# Altium schematic sheet ODChannel.SchDoc
size A2; SheetNumber: 2; SheetTotal: 2
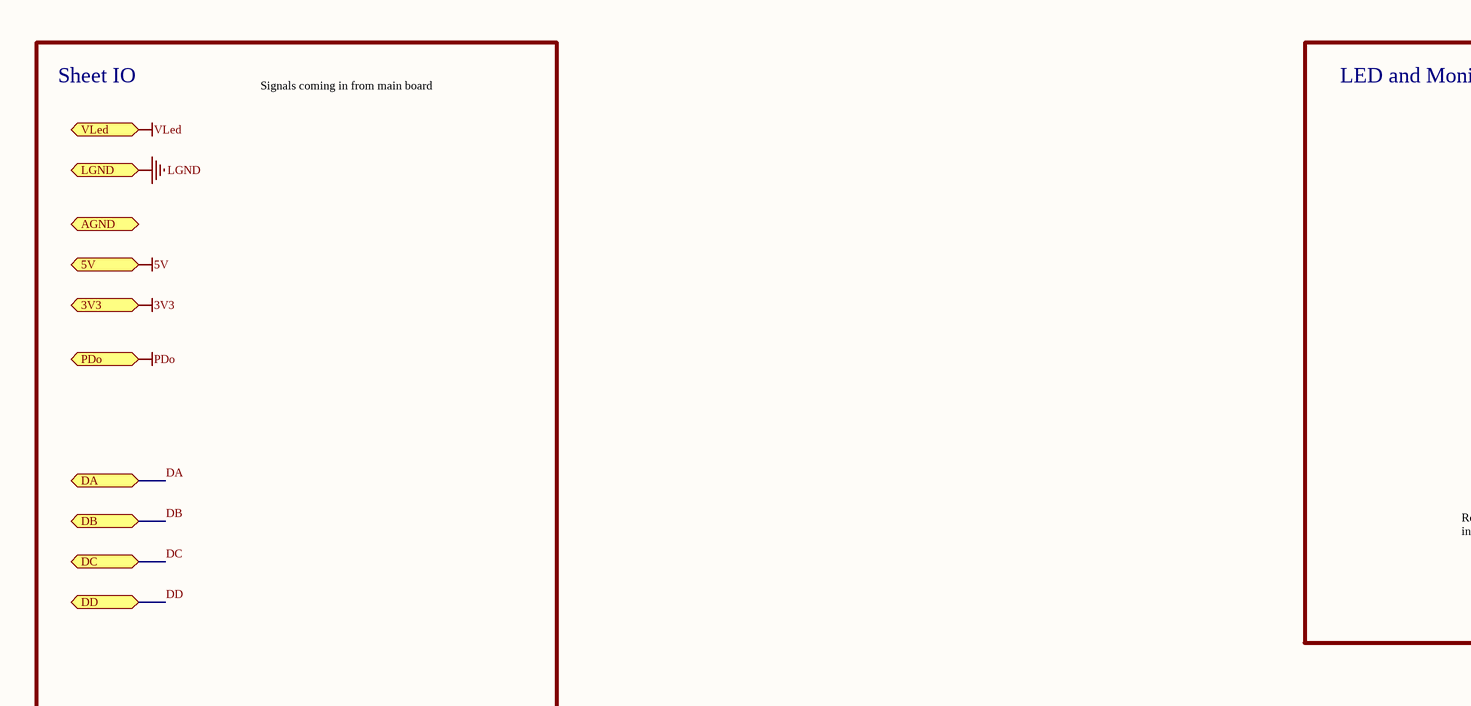
[diagram p0: ODChannel.SchDoc, left]
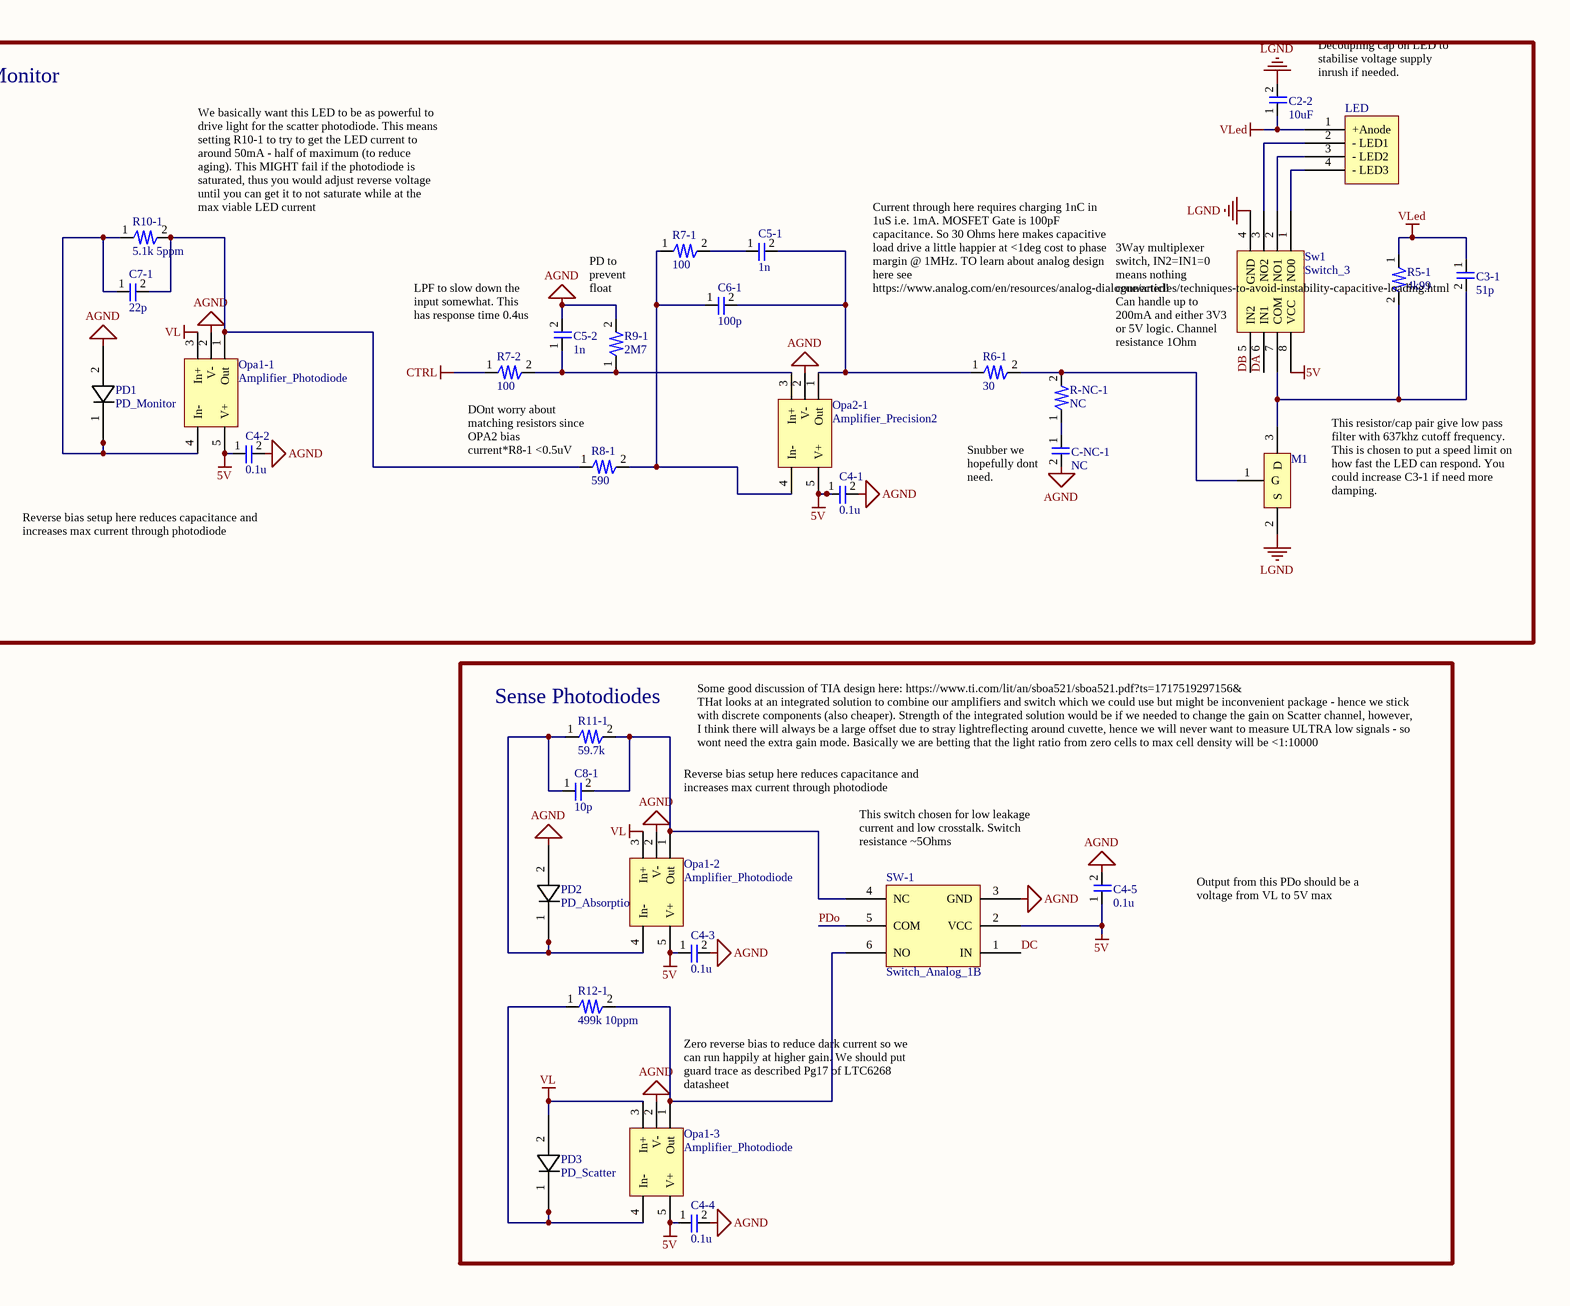
[diagram p1: ODChannel.SchDoc, right]

## Parts
C2-2  10uF  [1206]
C3-1  51p  [0805]
C4-1  0.1u  [0805]
C4-2  0.1u  [0805]
C4-3  0.1u  [0805]
C4-4  0.1u  [0805]
C4-5  0.1u  [0805]
C5-1  1n  [0805]
C5-2  1n  [0805]
C6-1  100p  [0805]
C7-1  22p  [0805]
C8-1  10p  [0805]
C-NC-1  NC  [0805]
LED  LEDx3 Header  [Header 2x2]  (value not drawn)
M1  MOSFET-N_2  [SOT23-3]  (value not drawn)
Opa1-1  Amplifier_Photodiode  [SOT23-5]
Opa1-2  Amplifier_Photodiode  [SOT23-5]
Opa1-3  Amplifier_Photodiode  [SOT23-5]
Opa2-1  Amplifier_Precision2  [SOT23-5]
PD1  PD_Monitor  [Photodiode_S6967]
PD2  PD_Absorption  [Photodiode_S6967]
PD3  PD_Scatter  [Photodiode_S6967]
R5-1  4k99  [0805]
R6-1  30  [0805]
R7-1  100  [0805]
R7-2  100  [0805]
R8-1  590  [0805]
R9-1  2M7  [0805]
R10-1  5.1k 5ppm  [0805]
R11-1  59.7k  [0805]
R12-1  499k 10ppm  [1206]
R-NC-1  NC  [0805]
Sw1  Switch_3  [8-VSSOP]
SW-1  Switch_Analog_1B  [6-TSSOP / SC-70-6]

## Blocks framed on the sheet
LED and Monitor: C2-2 C3-1 C4-1 C4-2 C5-1 C5-2 C6-1 C7-1 C-NC-1 LED M1 Opa1-1 Opa2-1 PD1 R5-1 R6-1 R7-1 R7-2 R8-1 R9-1 R10-1 R-NC-1 Sw1
Sense Photodiodes: C4-3-C4-5 C8-1 Opa1-2 Opa1-3 PD2 PD3 R11-1 R12-1 SW-1

## Ports
3V3 (bidir), 5V (bidir), AGND (bidir), DA (bidir), DB (bidir), DC (bidir), DD (bidir), LGND (bidir), PDo (bidir), VLed (bidir)

## Nets
3V3: port 3V3
5V: C4-1.1 C4-2.1 C4-3.1 C4-4.1 C4-5.1 Opa1-1.5(V+) Opa1-2.5(V+) Opa1-3.5(V+) Opa2-1.5(V+) Sw1.8(VCC) SW-1.2(VCC) ; port 5V
AGND: C4-1.2 C4-2.2 C4-3.2 C4-4.2 C4-5.2 C5-2.2 C-NC-1.2 Opa1-1.2(V-) Opa1-2.2(V-) Opa1-3.2(V-) Opa2-1.2(V-) PD1.2 PD2.2 R9-1.2 SW-1.3(GND)
CTRL: R7-2.1
LGND: C2-2.2 M1.2(S) Sw1.4(GND) ; port LGND
PDo: SW-1.5(COM) ; port PDo
VL: Opa1-1.3(In+) Opa1-2.3(In+) Opa1-3.3(In+) PD3.2
VLed: C2-2.1 C3-1.1 LED.1(+Anode) R5-1.1 ; port VLed
DA: Sw1.6(IN1) ; port DA
DB: Sw1.5(IN2) ; port DB
DC: SW-1.1(IN) ; port DC
DD: port DD
NetC3-1_2: C3-1.2 M1.3(D) R5-1.2 Sw1.7(COM)
NetC5-1_1: C5-1.1 R7-1.2
NetC5-1_2: C5-1.2 C6-1.2 Opa2-1.1(Out) R6-1.1
NetC5-2_1: C5-2.1 Opa2-1.3(In+) R7-2.2 R9-1.1
NetC6-1_1: C6-1.1 Opa2-1.4(In-) R7-1.1 R8-1.2
NetC7-1_1: C7-1.1 Opa1-1.4(In-) PD1.1 R10-1.1
NetC7-1_2: C7-1.2 Opa1-1.1(Out) R8-1.1 R10-1.2
NetC8-1_1: C8-1.1 Opa1-2.4(In-) PD2.1 R11-1.1
NetC8-1_2: C8-1.2 Opa1-2.1(Out) R11-1.2 SW-1.4(NC)
NetC-NC-1_1: C-NC-1.1 R-NC-1.1
NetLED_2: LED.2(-_LED1) Sw1.3(NO2)
NetLED_3: LED.3(-_LED2) Sw1.2(NO1)
NetLED_4: LED.4(-_LED3) Sw1.1(NO0)
NetM1_1: M1.1(G) R6-1.2 R-NC-1.2
NetOpa1-3_1: Opa1-3.1(Out) R12-1.2 SW-1.6(NO)
NetOpa1-3_4: Opa1-3.4(In-) PD3.1 R12-1.1

## Notes on the sheet
- Sheet IO
- Signals coming in from main board
- Decoupling cap on LED to stabilise voltage supply inrush if needed.
- (near R10-1) We basically want this LED to be as powerful to drive light for the scatter photodiode. This means setting R10-1 to try to get the LED current to around 50mA - half of maximum (to reduce aging). This MIGHT fail if the photodiode is saturated, thus you would adjust reverse voltage until you can get it to not saturate while at the max viable LED current
- LPF to slow down the input somewhat. This has response time 0.4us
- PD to prevent float
- Current through here requires charging 1nC in 1uS i.e. 1mA. MOSFET Gate is 100pF capacitance. So 30 Ohms here makes capacitive load drive a little happier at <1deg cost to phase margin @ 1MHz. TO learn about analog design here see https://www.analog.com/en/resources/analog-dialogue/articles/techniques-to-avoid-instability-capacitive-loading.html
- (near Sw1) 3Way multiplexer switch, IN2=IN1=0 means nothing connected!
  Can handle up to 200mA and either 3V3 or 5V logic. Channel resistance 1Ohm
- (near R8-1) DOnt worry about matching resistors since OPA2 bias current*R8-1 <0.5uV
- (near C-NC-1) Snubber we hopefully dont need.
- Reverse bias setup here reduces capacitance and increases max current through photodiode
- This resistor/cap pair give low pass filter with 637khz cutoff frequency. This is chosen to put a speed limit on how fast the LED can respond. You could increase C3-1 if need more damping.
- Some good discussion of TIA design here: https://www.ti.com/lit/an/sboa521/sboa521.pdf?ts=1717519297156&
  THat looks at an integrated solution to combine our amplifiers and switch which we could use but might be inconvenient package - hence we stick with discrete components (also cheaper). Strength of the integrated solution would be if we needed to change the gain on Scatter channel, however, I think there will always be a large offset due to stray lightreflecting around cuvette, hence we will never want to measure ULTRA low signals - so wont need the extra gain mode. Basically we are betting that the light ratio from zero cells to max cell density will be <1:10000
- This switch chosen for low leakage current and low crosstalk. Switch resistance ~5Ohms
- Output from this PDo should be a voltage from VL to 5V max
- (near Opa1-3) Zero reverse bias to reduce dark current so we can run happily at higher gain. We should put guard trace as described Pg17 of LTC6268 datasheet

## Library data of the parts
C2-2 = Capacitor1205: Digikey P/N: 1276-3100-1-ND
C3-1 C4-1-C4-5 C5-1 C5-2 C6-1 C7-1 C8-1 = Capacitor1
  C3-1 C7-1: Digikey P/N: 311-4239-1-ND
  C4-1-C4-5: Digikey P/N: 490-4789-1-ND
  C5-1 C5-2: Digikey P/N: 399-17971-1-ND
  C6-1: Digikey P/N: 399-6916-1-ND
  C8-1: Digikey P/N: 399-15978-1-ND
C-NC-1 = Capacitor1: Notes: 0.1u nominal
Opa1-1-Opa1-3 = Amplifier_Precision2: Digikey P/N: 296-OPA328DBVRCT-ND
PD1-PD3 = Photodiode_S6967: Digikey P/N: None
R5-1 R6-1 R7-1 R7-2 R8-1 R9-1 R10-1 R11-1 R12-1 = Res1
  R5-1 R6-1: Digikey P/N: P4.99KCCT-ND
  R7-1 R7-2: Digikey P/N: 738-RNCF0805DTE100RCT-ND
  R8-1: Digikey P/N: 10-ERA-6AEB5900VCT-ND
  R9-1: Digikey P/N: 408-2028-1-ND
  R10-1: Digikey P/N: 2019-RN73R2ATTD5101A05CT-ND
  R11-1: Digikey P/N: 2019-RN73R2ATTD5972A05CT-ND
  R12-1: Digikey P/N: 13-VT1206BRB07499KLCT-ND
R-NC-1 = Res1: Notes: 30 nominal
M1 = MOSFET-N_2: Digikey P/N: 31-DMN2310U-7CT-ND, DMN2300U-7DICT-ND
Opa2-1 = Amplifier_Precision2: Digikey P/N: 296-OPA388QDBVRQ1CT-ND
Sw1 = Switch_3: Digikey P/N: 296-21193-1-ND
SW-1 = Switch_Analog_1B: Digikey P/N: 296-22731-1-ND